# Altium schematic sheet P9_MIDI.SchDoc
size 152 x 152 mm
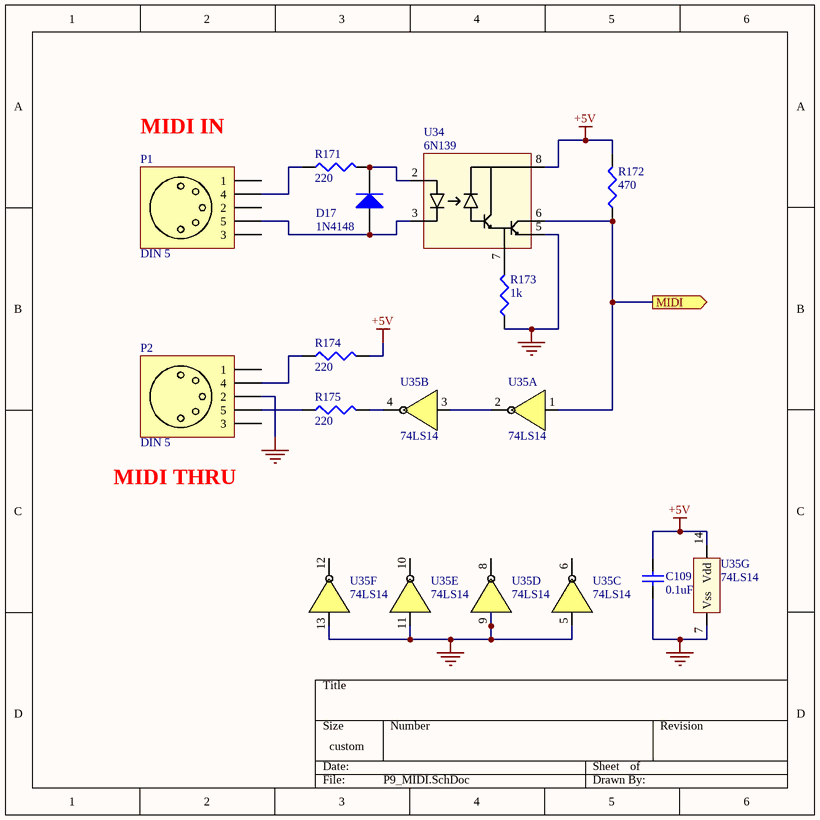
[diagram p0: P9_MIDI.SchDoc]

## Parts
C109  0.1uF  [CAP 0603 (1608 metric)]
D17  1N4148
P1  DIN 5
P2  DIN 5
R171  220  [RES 0603 (1608 metric)]
R172  470  [RES 0603 (1608 metric)]
R173  1k  [RES 0603 (1608 metric)]
R174  220  [RES 0603 (1608 metric)]
R175  220  [RES 0603 (1608 metric)]
U34  6N139
U35  74LS14  (parts A,B,C,D,E,F,G of 7)

## Ports
MIDI (out)

## Nets
+5V: C109.1 R172.2 R174.2 U34.8(B1) U35.14(Vdd)
GND: C109.2 P2.2 R173.1 U34.5(B1) U35.5(C) U35.7(Vss) U35.9(D) U35.11(E) U35.13(F)
MIDI: R172.1 U34.6(B1) U35.1(A) ; port MIDI
NetD17_1: D17.1(A) P1.5 U34.3(B1)
NetD17_2: D17.2(K) R171.2 U34.2(B2)
NetP1_4: P1.4 R171.1
NetP2_4: P2.4 R174.1
NetP2_5: P2.5 R175.1
NetR173_2: R173.2 U34.7(B1)
NetR175_2: R175.2 U35.4(~{B})
NetU35_2: U35.2(~{A}) U35.3(B)

Not connected (* = marked no-connect by the designer): P1 1 2 3; P2 1 3; U35 6(~{C}) 8(~{D}) 10(~{E}) 12(~{F})

## Notes on the sheet
- (near P1) MIDI IN
- (near P2) MIDI THRU

## Library data of the parts
C109 = Cap Semi: Capacitor (Semiconductor SIM Model); Value: 0.1uF
D17 = Diode 1N4148: High Conductance Fast Diode
P1 P2 = DIN 5pin
R171-R175 = Res3: Resistor
  R171 R174 R175: Value: 220
  R172: Value: 470
  R173: Value: 1k
U34 = 6N139: Optocoupler
U35 = 74LS14: Hex Inverter